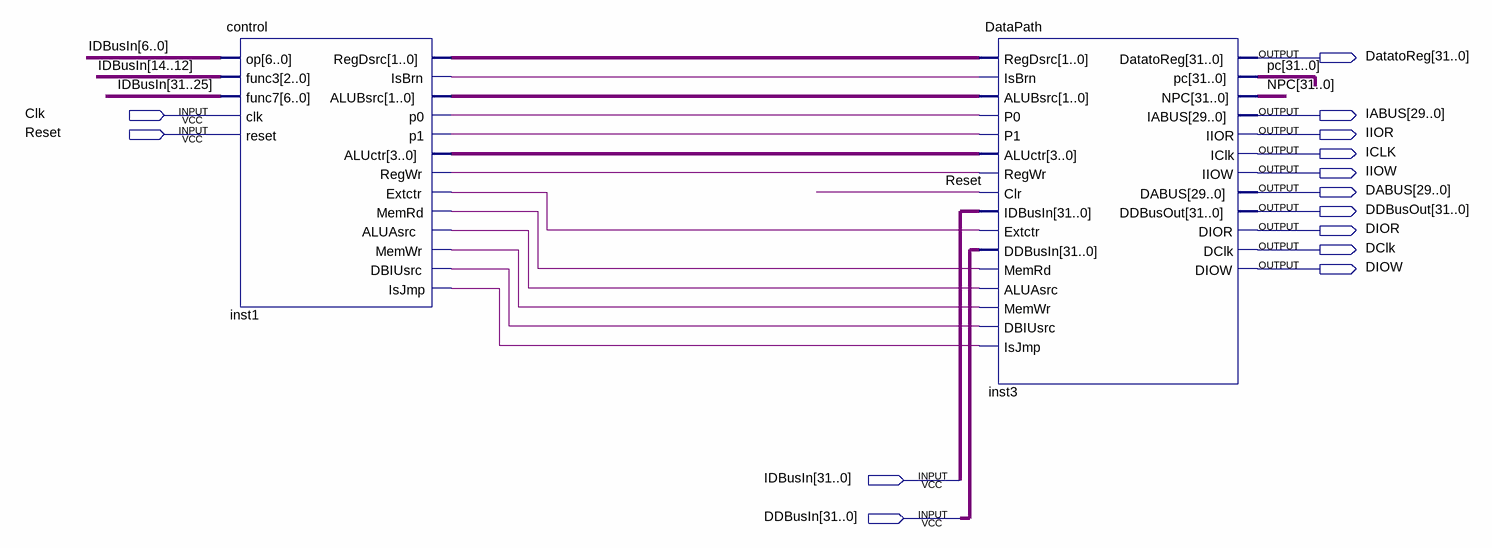
[diagram p0: schematic sheet]
// Quartus schematic cpu.bdf as structural Verilog: 2 symbols, 14 pins
module cpu (
  input  Clk,
  input  Reset,
  input  [31:0] IDBusIn,
  input  [31:0] DDBusIn,
  output [31:0] DatatoReg,
  output [29:0] IABUS,
  output IIOR,
  output ICLK,
  output IIOW,
  output [29:0] DABUS,
  output [31:0] DDBusOut,
  output DIOR,
  output DClk,
  output DIOW
);

  wire inst1_aluasrc, inst1_dbiusrc, inst1_extctr, inst1_isbrn, inst1_isjmp, inst1_memrd, inst1_memwr,
       inst1_p0, inst1_p1, inst1_regwr;
  wire [1:0] inst1_alubsrc, inst1_regdsrc;
  wire [3:0] inst1_aluctr;
  wire [31:0] NPC, pc;

  control inst1 (
    .op(IDBusIn[6:0]), .func3(IDBusIn[14:12]), .func7(IDBusIn[31:25]), .clk(Clk), .reset(Reset),
    .RegDsrc(inst1_regdsrc), .IsBrn(inst1_isbrn), .ALUBsrc(inst1_alubsrc), .p0(inst1_p0), .p1(inst1_p1),
    .ALUctr(inst1_aluctr), .RegWr(inst1_regwr), .Extctr(inst1_extctr), .MemRd(inst1_memrd),
    .ALUAsrc(inst1_aluasrc), .MemWr(inst1_memwr), .DBIUsrc(inst1_dbiusrc), .IsJmp(inst1_isjmp));
  DataPath inst3 (
    .RegDsrc(inst1_regdsrc), .IsBrn(inst1_isbrn), .ALUBsrc(inst1_alubsrc), .P0(inst1_p0), .P1(inst1_p1),
    .ALUctr(inst1_aluctr), .RegWr(inst1_regwr), .Clr(Reset), .IDBusIn(IDBusIn), .Extctr(inst1_extctr),
    .DDBusIn(DDBusIn), .MemRd(inst1_memrd), .ALUAsrc(inst1_aluasrc), .MemWr(inst1_memwr),
    .DBIUsrc(inst1_dbiusrc), .IsJmp(inst1_isjmp), .DatatoReg(DatatoReg), .pc(pc), .NPC(NPC), .IABUS(IABUS),
    .IIOR(IIOR), .IClk(ICLK), .IIOW(IIOW), .DABUS(DABUS), .DDBusOut(DDBusOut), .DIOR(DIOR), .DClk(DClk),
    .DIOW(DIOW));
endmodule
